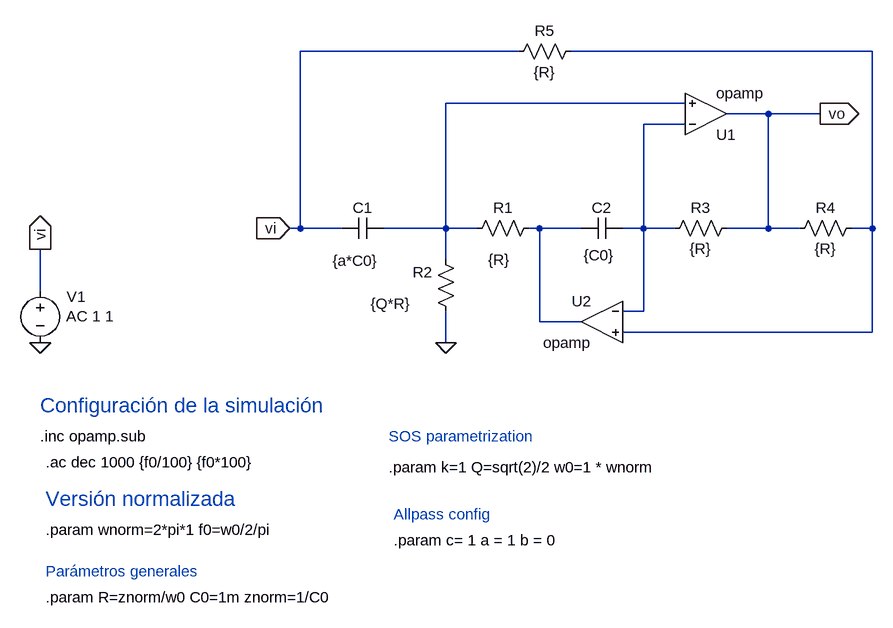
[diagram p0: schematic GIC allpass norm.ASC.asc]
GIC allpass norm.ASC.asc, the LTspice schematic file:
Version 4
SHEET 1 2616 1448
WIRE -16 -64 -352 -64
WIRE 528 -64 64 -64
WIRE 240 16 -128 16
WIRE 368 32 304 32
WIRE 448 32 368 32
WIRE 240 48 176 48
WIRE -352 208 -352 -64
WIRE -352 208 -368 208
WIRE -288 208 -352 208
WIRE -128 208 -128 16
WIRE -128 208 -224 208
WIRE -80 208 -128 208
WIRE 16 208 0 208
WIRE 80 208 16 208
WIRE 176 208 176 48
WIRE 176 208 144 208
WIRE 224 208 176 208
WIRE 368 208 368 32
WIRE 368 208 304 208
WIRE 416 208 368 208
WIRE 528 208 528 -64
WIRE 528 208 496 208
WIRE -128 256 -128 208
WIRE -752 304 -752 240
WIRE 176 336 176 208
WIRE 176 336 144 336
WIRE 16 352 16 208
WIRE 80 352 16 352
WIRE 528 368 528 208
WIRE 528 368 144 368
WIRE -128 384 -128 336
FLAG -368 208 vi
IOPIN -368 208 In
FLAG 448 32 vo
IOPIN 448 32 Out
FLAG -128 384 0
FLAG -752 384 0
FLAG -752 240 vi
IOPIN -752 240 Out
SYMBOL res -96 224 R270
WINDOW 0 32 56 VTop 2
WINDOW 3 -17 50 VBottom 2
SYMATTR InstName R1
SYMATTR Value {R}
SYMBOL res 208 224 R270
WINDOW 0 32 56 VTop 2
WINDOW 3 0 56 VBottom 2
SYMATTR InstName R3
SYMATTR Value {R}
SYMBOL res 400 224 R270
WINDOW 0 32 56 VTop 2
WINDOW 3 0 56 VBottom 2
SYMATTR InstName R4
SYMATTR Value {R}
SYMBOL cap 80 224 R270
WINDOW 0 32 32 VTop 2
WINDOW 3 -10 28 VBottom 2
SYMATTR InstName C2
SYMATTR Value {C0}
SYMBOL OpAmps\\opamp 272 96 M180
SYMATTR InstName U1
SYMBOL OpAmps\\opamp 112 288 M0
SYMATTR InstName U2
SYMBOL res -112 352 R180
WINDOW 0 36 76 Left 2
WINDOW 3 70 28 Left 2
SYMATTR InstName R2
SYMATTR Value {Q*R}
SYMBOL cap -224 192 R90
WINDOW 0 0 32 VBottom 2
WINDOW 3 50 43 VTop 2
SYMATTR InstName C1
SYMATTR Value {a*C0}
SYMBOL res -32 -48 R270
WINDOW 0 32 56 VTop 2
WINDOW 3 0 56 VBottom 2
SYMATTR InstName R5
SYMATTR Value {R}
SYMBOL voltage -752 288 R0
WINDOW 123 40 55 Left 2
WINDOW 39 0 0 Left 0
WINDOW 0 41 25 Left 2
SYMATTR Value2 AC 1 1
SYMATTR InstName V1
SYMATTR Value ""
TEXT -752 528 Left 2 !.inc opamp.sub
TEXT -744 568 Left 2 !.ac dec 1000 {f0/100} {f0*100}
TEXT -744 624 Left 3 ;Versión normalizada
TEXT -744 672 Left 2 !.param wnorm=2*pi*1 f0=w0/2/pi
TEXT -744 776 Left 2 !.param R=znorm/w0 C0=1m znorm=1/C0
TEXT -752 480 Left 3 ;Configuración de la simulación
TEXT -216 576 Left 2 !.param k=1 Q=sqrt(2)/2 w0=1 * wnorm
TEXT -208 648 Left 2 ;Allpass config
TEXT -208 688 Left 2 !.param c= 1 a = 1 b = 0
TEXT -744 736 Left 2 ;Parámetros generales
TEXT -216 528 Left 2 ;SOS parametrization

The netlist it stands for:
* GIC allpass norm.ASC.asc
R1 N002 N004 {R}
R3 N003 vo {R}
R4 vo N001 {R}
C2 N004 N003 {C0}
XU1 N003 N002 vo opamp Aol=100K GBW=10Meg  ; pins invin noninvin out
XU2 N003 N001 N004 opamp Aol=100K GBW=10Meg  ; pins invin noninvin out
R2 0 N002 {Q*R}
C1 N002 vi {a*C0}
R5 vi N001 {R}
V1 vi 0 AC 1 1
.inc opamp.sub
.ac dec 1000 {f0/100} {f0*100}
* Versión normalizada
.param wnorm=2*pi*1 f0=w0/2/pi
.param R=znorm/w0 C0=1m znorm=1/C0
* Configuración de la simulación
.param k=1 Q=sqrt(2)/2 w0=1 * wnorm
* Allpass config
.param c= 1 a = 1 b = 0
* Parámetros generales
* SOS parametrization
.backanno
.end